# Altium schematic sheet Converter_Dif-Se.SchDoc
size A
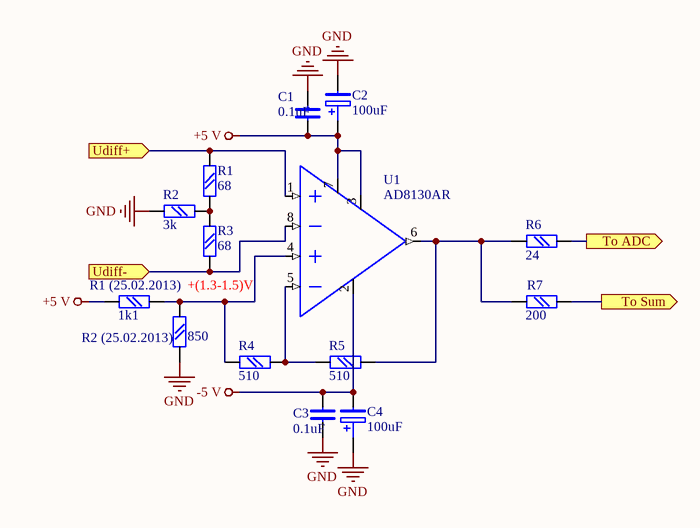
[diagram p0: Converter_Dif-Se.SchDoc]

## Parts
C1  0.1uF  [chip0805]
C2  100uF  [CEL-SMD300]
C3  0.1uF  [chip0805]
C4  100uF  [CEL-SMD300]
R1  68  [chip0805]
R1_(25.02.2013)  1k1  [chip0805]
R2  3k  [chip0805]
R2_(25.02.2013)  850  [chip0805]
R3  68  [chip0805]
R4  510  [chip0805]
R5  510  [chip0805]
R6  24  [chip0805]
R7  200  [chip0805]
U1  AD8130AR  [SO-8]

## Ports
To ADC (out), To Sum (out), Udiff+ (in), Udiff- (in)

## Nets
+5 V: C1.2 C2.+ R1_(25.02.2013).2 U1.3(PD) U1.7(E+)
-5 V: C3.1 C4.- U1.2(E-)
GND: C1.1 C2.- C3.2 C4.+ R2.2 R2_(25.02.2013).1
To ADC: R6.2 ; port To ADC
To Sum: R7.2 ; port To Sum
Udiff+: R1.1 U1.1(+IN) ; port Udiff+
Udiff-: R3.2 U1.8(-IN) ; port Udiff-
NetR1_2: R1.2 R2.1 R3.1
NetR1_(25.02.2013)_1: R1_(25.02.2013).1 R2_(25.02.2013).2 R4.2 U1.4(IN+)
NetR4_1: R4.1 R5.1 U1.5(IN-)
NetR5_2: R5.2 R6.1 R7.1 U1.6(OUT)

## Notes on the sheet
- +(1.3-1.5)V

## Library data of the parts
C1 C3 = C: Text Field1: 20; Text Field2: 10
C2 C4 = C POL: Text Field1: 20; Text Field2: 20
R1 R1_(25.02.2013) R2 R2_(25.02.2013) R3-R7 = R: Text Field1: 20; Text Field2: 20
U1 = AD8130